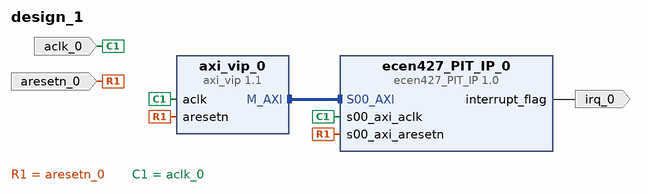
[diagram p0: block diagram of the top level]
# Vivado block design design_1, xc7z020clg400-1, Vivado 2017.4
create_bd_design design_1

create_bd_port -dir I aresetn_0
create_bd_port -dir I aclk_0
create_bd_port -dir O -type intr irq_0

create_bd_cell -type ip -vlnv xilinx.com:ip:axi_vip:1.1 axi_vip_0
set_property -dict [list \
  CONFIG.PROTOCOL AXI4LITE \
  CONFIG.READ_WRITE_MODE READ_WRITE \
  CONFIG.INTERFACE_MODE MASTER \
  CONFIG.ADDR_WIDTH 32 \
  CONFIG.DATA_WIDTH 32 \
  CONFIG.HAS_PROT 1 \
  CONFIG.HAS_WSTRB 1 \
  CONFIG.HAS_BRESP 1 \
  CONFIG.HAS_RRESP 1 \
] [get_bd_cells axi_vip_0]
create_bd_cell -type ip -vlnv user.org:user:ecen427_PIT_IP:1.0 ecen427_PIT_IP_0

# ---- connections ----

connect_bd_intf_net [get_bd_intf_pins ecen427_PIT_IP_0/S00_AXI] [get_bd_intf_pins axi_vip_0/M_AXI]
connect_bd_net [get_bd_ports aresetn_0] [get_bd_pins axi_vip_0/aresetn] [get_bd_pins ecen427_PIT_IP_0/s00_axi_aresetn]
connect_bd_net [get_bd_ports aclk_0] [get_bd_pins axi_vip_0/aclk] [get_bd_pins ecen427_PIT_IP_0/s00_axi_aclk]
connect_bd_net [get_bd_pins ecen427_PIT_IP_0/interrupt_flag] [get_bd_ports irq_0]

# ---- address map ----
assign_bd_address -offset 0x44A00000 -range 64K -target_address_space [get_bd_addr_spaces axi_vip_0/Master_AXI] [get_bd_addr_segs ecen427_PIT_IP_0/S00_AXI/S00_AXI_reg]

validate_bd_design
save_bd_design
